# Altium project pca10095.PrjPCB (part 2 of 4)

## Sheet pca10095_sheet4_misc.SchDoc: PCA10095 - Miscellaneous
size A3; Organization: Nordic Semiconductor; DocumentNumber: 4; Revision: 0.8.0; SheetNumber: 4; SheetTotal: 6; Author: GETR; CompanyName: Nordic Semiconductor; DrawnBy: GETR; ProjectName: nRF53 Development Kit
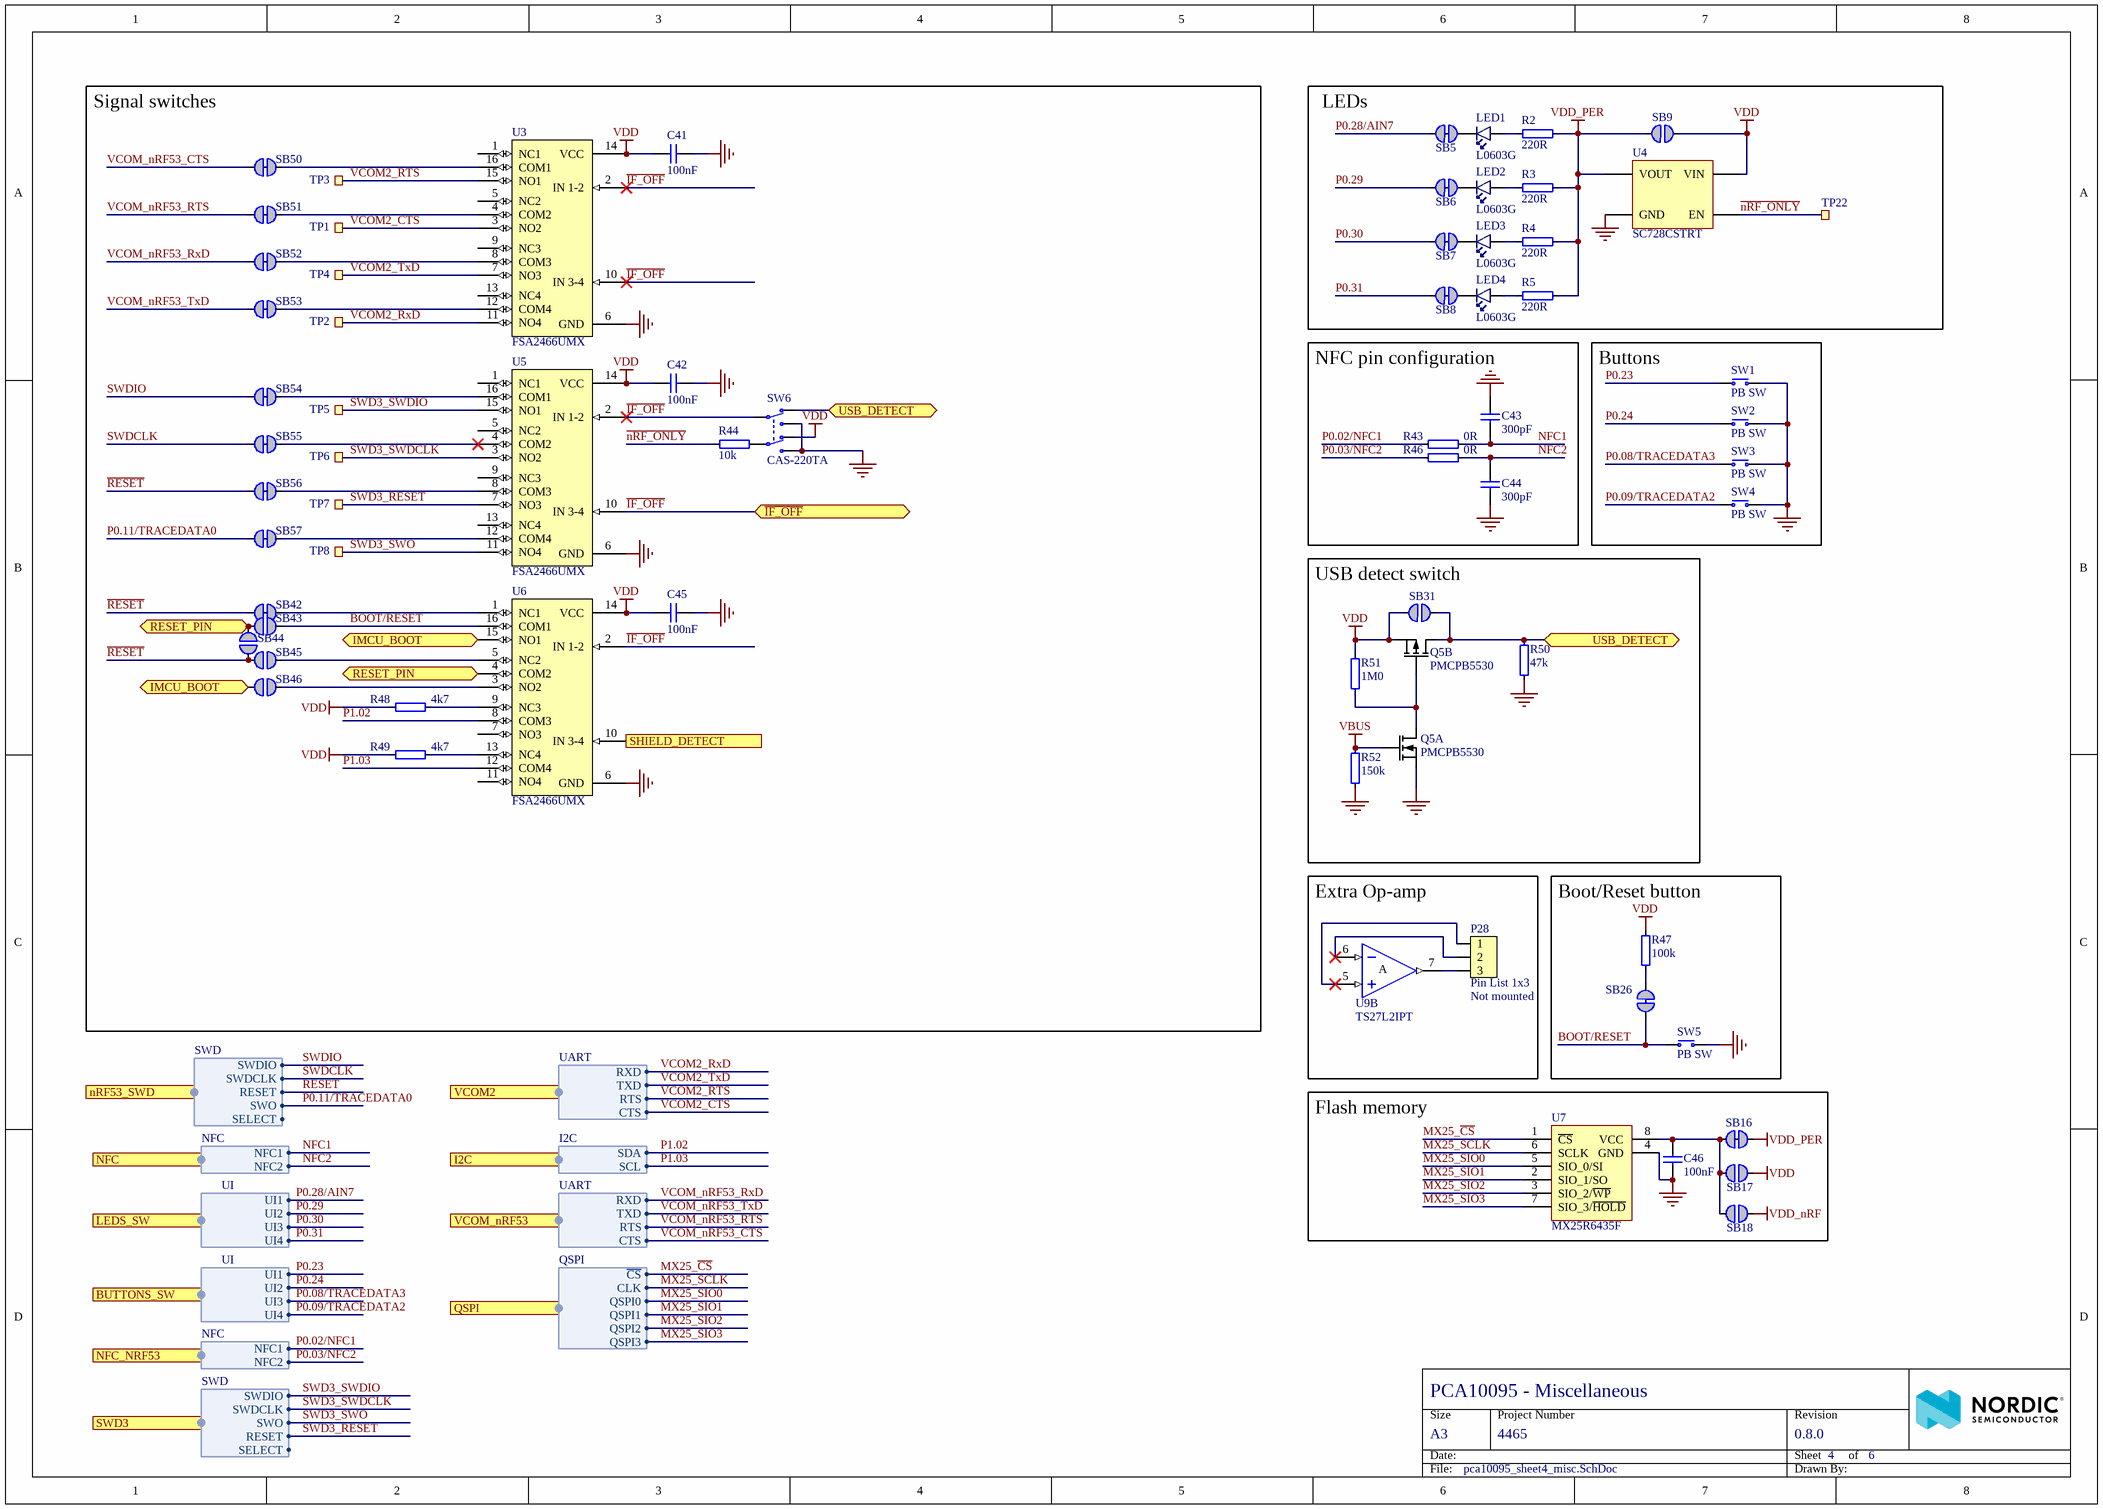
[diagram p3: pca10095_sheet4_misc.SchDoc]

### Parts
C41  100nF  [CAPC0603X03L_C]
C42  100nF  [CAPC0603X03L_C]
C43  300pF  [CAPC1005X04L]
C44  300pF  [CAPC1005X04L]
C45  100nF  [CAPC0603X03L_C]
C46  100nF  [CAPC0603X03L_C]
LED1  L0603G  [LED_0603_G]
LED2  L0603G  [LED_0603_G]
LED3  L0603G  [LED_0603_G]
LED4  L0603G  [LED_0603_G]
P28  Pin List 1x3  Assembly: Not mounted  [LIST_1x3-NC]
Q5  PMCPB5530  [PMCPB5530X]  (parts A,B of 2)
R2  220R  [RESC0603X03L_C]
R3  220R  [RESC0603X03L_C]
R4  220R  [RESC0603X03L_C]
R5  220R  [RESC0603X03L_C]
R43  0R  [RESC0603X03L_C]
R44  10k  [RESC0603X03L_C]
R46  0R  [RESC0603X03L_C]
R47  100k  [RESC0603X03L_C]
R48  4k7  [RESC0603X03L_C]
R49  4k7  [RESC0603X03L_C]
R50  47k  [RESC0603X03L_C]
R51  1M0  [RESC0603X03L_C]
R52  150k  [RESC0603X03L_C]
SB5  Solderbridge  [Solderbridge_Shorted]  (value not drawn)  (net tie, no BOM)
SB6  Solderbridge  [Solderbridge_Shorted]  (value not drawn)  (net tie, no BOM)
SB7  Solderbridge  [Solderbridge_Shorted]  (value not drawn)  (net tie, no BOM)
SB8  Solderbridge  [Solderbridge_Shorted]  (value not drawn)  (net tie, no BOM)
SB9  Solderbridge  [Solderbridge]  (value not drawn)  (no BOM)
SB16  Solderbridge  [Solderbridge_Shorted]  (value not drawn)  (net tie, no BOM)
SB17  Solderbridge  [Solderbridge]  (value not drawn)  (no BOM)
SB18  Solderbridge  [Solderbridge]  (value not drawn)  (no BOM)
SB26  Solderbridge  [Solderbridge_Shorted]  (value not drawn)  (net tie, no BOM)
SB31  Solderbridge  [Solderbridge]  (value not drawn)  (no BOM)
SB42  Solderbridge  [Solderbridge_Shorted]  (value not drawn)  (net tie, no BOM)
SB43  Solderbridge  [Solderbridge]  (value not drawn)  (no BOM)
SB44  Solderbridge  [Solderbridge]  (value not drawn)  (no BOM)
SB45  Solderbridge  [Solderbridge]  (value not drawn)  (no BOM)
SB46  Solderbridge  [Solderbridge]  (value not drawn)  (no BOM)
SB50  Solderbridge  [Solderbridge_Shorted]  (value not drawn)  (net tie, no BOM)
SB51  Solderbridge  [Solderbridge_Shorted]  (value not drawn)  (net tie, no BOM)
SB52  Solderbridge  [Solderbridge_Shorted]  (value not drawn)  (net tie, no BOM)
SB53  Solderbridge  [Solderbridge_Shorted]  (value not drawn)  (net tie, no BOM)
SB54  Solderbridge  [Solderbridge_Shorted]  (value not drawn)  (net tie, no BOM)
SB55  Solderbridge  [Solderbridge_Shorted]  (value not drawn)  (net tie, no BOM)
SB56  Solderbridge  [Solderbridge_Shorted]  (value not drawn)  (net tie, no BOM)
SB57  Solderbridge  [Solderbridge_Shorted]  (value not drawn)  (net tie, no BOM)
SW1  PB SW  [Switch-PB-6.2x6.3mm-SMD]
SW2  PB SW  [Switch-PB-6.2x6.3mm-SMD]
SW3  PB SW  [Switch-PB-6.2x6.3mm-SMD]
SW4  PB SW  [Switch-PB-6.2x6.3mm-SMD]
SW5  PB SW  [Switch-PB-6.2x6.3mm-SMD]
SW6  CAS-220TA  [CAS-220TA]
TP1  Ø1.5mm,SMD  [TP_SMD_Ø1.5mm]  (value not drawn)  (no BOM)
TP2  Ø1.5mm,SMD  [TP_SMD_Ø1.5mm]  (value not drawn)  (no BOM)
TP3  Ø1.5mm,SMD  [TP_SMD_Ø1.5mm]  (value not drawn)  (no BOM)
TP4  Ø1.5mm,SMD  [TP_SMD_Ø1.5mm]  (value not drawn)  (no BOM)
TP5  Ø1.5mm,SMD  [TP_SMD_Ø1.5mm]  (value not drawn)  (no BOM)
TP6  Ø1.5mm,SMD  [TP_SMD_Ø1.5mm]  (value not drawn)  (no BOM)
TP7  Ø1.5mm,SMD  [TP_SMD_Ø1.5mm]  (value not drawn)  (no BOM)
TP8  Ø1.5mm,SMD  [TP_SMD_Ø1.5mm]  (value not drawn)  (no BOM)
TP22  Ø1.5mm,SMD  [TP_SMD_Ø1.5mm]  (value not drawn)  (no BOM)
U3  FSA2466UMX  [XQFN40P180X260X50-16N]
U4  SC728CSTRT  [BGA4C40P2X2_76X76X62]
U5  FSA2466UMX  [XQFN40P180X260X50-16N]
U6  FSA2466UMX  [XQFN40P180X260X50-16N]
U7  MX25R6435F  [SON127P600X80_HS-9N]
U9  TS27L2IPT  [TSOP65P640X120-8N]  (part B of 2)

### Blocks framed on the sheet
Signal switches: C41 C42 C45 R44 R48 R49 SB42-SB46 SB50-SB57 SW6 TP1-TP8 U3 U5 U6
LEDs: LED1-LED4 R2-R5 SB5-SB9 TP22 U4
NFC pin configuration: C43 C44 R43 R46
Buttons: SW1-SW4
USB detect switch: Q5 R50-R52 SB31
Extra Op-amp: P28 U9
Boot/Reset button: R47 SB26 SW5
Flash memory: C46 SB16-SB18 U7

### Ports
BUTTONS_SW (harness UI), I2C (harness I2C), IMCU_BOOT (bidir), LEDS_SW (harness UI), NFC (harness NFC), NFC_NRF53 (harness NFC), nRF53_SWD (harness SWD), QSPI (harness QSPI), RESET_PIN (bidir), SHIELD_DETECT (in), SWD3 (harness SWD), USB_DETECT (bidir), VCOM2 (harness UART), VCOM_nRF53 (harness UART), ~{IF_OFF} (bidir)

### Harnesses
SWD: SWDIO, SWDCLK, SWO, RESET, SELECT
NFC: NFC2, NFC1
UI: UI4, UI3, UI2, UI1
QSPI: ~{CS}, QSPI0, CLK, QSPI1, QSPI2, QSPI3
UART: RTS, CTS, RXD, TXD
I2C: SCL, SDA

### Nets
GND: C41.1 C42.1 C43.2 C44.1 C45.1 C46.1 Q5.1(S1) R50.2 R52.2 SW1.1(N.O) SW2.1(N.O) SW3.1(N.O) SW4.1(N.O) SW5.1(N.O) SW6.1(N.O-1) SW6.4(N.O-2) U3.6(GND) U4.B1(GND) U5.6(GND) U6.6(GND) U7.4(GND) U7.9(GND)
VBUS: Q5.2(G1) R52.1
VDD: C41.2 C42.2 C45.2 Q5.4(S2) R47.2 R48.1 R49.1 R51.1 SB9.1 SB17.1 SB31.1 SW6.6(N.C-2) U3.14(VCC) U4.A2(VIN) U5.14(VCC) U6.14(VCC)
VDD_nRF: SB18.1
VDD_PER: R2.2 R3.2 R4.2 R5.2 SB9.2 SB16.1 U4.A1(VOUT)
BOOT/RESET: SB26.1 SB43.1 SW5.2(COM) U6.16(COM1)
~{IF_OFF}: SW6.2(COM-1) U3.2(IN_1-2) U3.10(IN_3-4) U5.2(IN_1-2) U5.10(IN_3-4) U6.2(IN_1-2) ; port ~{IF_OFF}
IMCU_BOOT: SB46.2 U6.15(NO1) ; port IMCU_BOOT
MX25_~{CS}: U7.1(~{CS}) ; port QSPI.~{CS}
MX25_SCLK: U7.6(SCLK) ; port QSPI.CLK
MX25_SIO0: U7.5(SIO_0/SI) ; port QSPI.QSPI0
MX25_SIO1: U7.2(SIO_1/SO) ; port QSPI.QSPI1
MX25_SIO2: U7.3(SIO_2/~{WP}) ; port QSPI.QSPI2
MX25_SIO3: U7.7(SIO_3/~{HOLD}) ; port QSPI.QSPI3
~{nRF_ONLY}: R44.1 TP22.1 U4.B2(EN)
NFC1: C43.1 R43.1 ; port NFC.NFC1
NFC2: C44.2 R46.1 ; port NFC.NFC2
P0.02/NFC1: R43.2 ; port NFC_NRF53.NFC1
P0.03/NFC2: R46.2 ; port NFC_NRF53.NFC2
P0.08/TRACEDATA3: SW3.2(COM) ; port BUTTONS_SW.UI3
P0.09/TRACEDATA2: SW4.2(COM) ; port BUTTONS_SW.UI4
P0.11/TRACEDATA0: SB57.1 ; port nRF53_SWD.SWO
P0.23: SW1.2(COM) ; port BUTTONS_SW.UI1
P0.24: SW2.2(COM) ; port BUTTONS_SW.UI2
P0.28/AIN7: SB5.1 ; port LEDS_SW.UI1
P0.29: SB6.1 ; port LEDS_SW.UI2
P0.30: SB7.1 ; port LEDS_SW.UI3
P0.31: SB8.1 ; port LEDS_SW.UI4
P1.02: U6.8(COM3) ; port I2C.SDA
P1.03: U6.12(COM4) ; port I2C.SCL
~{RESET}: SB42.2 SB44.2 SB45.2 SB56.1 ; port nRF53_SWD.RESET
SWD3_RESET: TP7.1 U5.7(NO3) ; port SWD3.RESET
SWD3_SWDCLK: TP6.1 U5.3(NO2) ; port SWD3.SWDCLK
SWD3_SWDIO: TP5.1 U5.15(NO1) ; port SWD3.SWDIO
SWD3_SWO: TP8.1 U5.11(NO4) ; port SWD3.SWO
SWDCLK: SB55.1 ; port nRF53_SWD.SWDCLK
SWDIO: SB54.1 ; port nRF53_SWD.SWDIO
VCOM2_CTS: TP1.1 U3.3(NO2) ; port VCOM2.CTS
VCOM2_RTS: TP3.1 U3.15(NO1) ; port VCOM2.RTS
VCOM2_RxD: TP2.1 U3.11(NO4) ; port VCOM2.RXD
VCOM2_TxD: TP4.1 U3.7(NO3) ; port VCOM2.TXD
VCOM_nRF53_CTS: SB50.1 ; port VCOM_nRF53.CTS  [project net P0.21]
VCOM_nRF53_RTS: SB51.1 ; port VCOM_nRF53.RTS  [project net P0.19]
VCOM_nRF53_RxD: SB52.1 ; port VCOM_nRF53.RXD  [project net P0.22]
VCOM_nRF53_TxD: SB53.1 ; port VCOM_nRF53.TXD  [project net P0.20]
NetC46_2: C46.2 SB16.2 SB17.2 SB18.2 U7.8(VCC)
NetLED1_1: LED1.1(C) SB5.2
NetLED1_2: LED1.2(A) R2.1
NetLED2_1: LED2.1(C) SB6.2
NetLED2_2: LED2.2(A) R3.1
NetLED3_1: LED3.1(C) SB7.2
NetLED3_2: LED3.2(A) R4.1
NetLED4_1: LED4.1(C) SB8.2
NetLED4_2: LED4.2(A) R5.1
NetP1_3: SB43.2 SB44.1 U6.4(COM2) ; port RESET_PIN
NetP28_1: P28.1 U9.5(IN2+)
NetP28_2: P28.2 U9.6(IN2-)
NetP28_3: P28.3 U9.7(OUT2)
NetQ5_3: Q5.3(D2) R50.1 SB31.2 SW6.3(N.C-1) ; port USB_DETECT
NetQ5_5: Q5.5(G2) Q5.6(D1) R51.2
NetR44_2: R44.2 SW6.5(COM-2)
NetR47_1: R47.1 SB26.2
NetR48_2: R48.2 U6.9(NC3)
NetR49_2: R49.2 U6.13(NC4)
NetR57_1: U6.10(IN_3-4) ; port SHIELD_DETECT
NetSB42_1: SB42.1 U6.1(NC1)
NetSB45_1: SB45.1 U6.5(NC2)
NetSB46_1: SB46.1 U6.3(NO2)
NetSB50_2: SB50.2 U3.16(COM1)
NetSB51_2: SB51.2 U3.4(COM2)
NetSB52_2: SB52.2 U3.8(COM3)
NetSB53_2: SB53.2 U3.12(COM4)
NetSB54_2: SB54.2 U5.16(COM1)
NetSB55_2: SB55.2 U5.4(COM2)
NetSB56_2: SB56.2 U5.8(COM3)
NetSB57_2: SB57.2 U5.12(COM4)

Not connected (* = marked no-connect by the designer): U3 1(NC1) 5(NC2) 9(NC3) 13(NC4); U5 1(NC1) 5(NC2) 9(NC3) 13(NC4); U6 7(NO3) 11(NO4)

### Notes on the sheet
- Size
- Date:
- A3
- Project Number
- Sheet         of
- Revision
- File:
- Drawn By:
- (in symbol TS27L2IPT, part B) A

### Library data of the parts
C41 C42 C45 C46 = C0201-100n: Capacitor, X5R, ±10%; Part number IPS: 00000001248; Note: 16V; Artikkelnr Noca: N.A.; Part Number: C0201-100n; Manufacturer: *; Manufacturer Part Number: *; Footprint Doc: 0201; LatestRevisionDate: 2017-11-09; Pin Count: 2; Publisher: Nordic Semiconductor; Published: 2014-11-13; Value: 100nF; ComponentLink1URL: *; ComponentLink1Description: Datasheet; ComponentLink2URL: *; ComponentLink2Description: Supplier link; HelpURL: *; Supplier 1: *; Supplier Part Number 1: *; Supplier 2: *; Supplier Part Number 2: *
C43 C44 = C0402-300p: Capacitor, NP0, ±5%; Part number IPS: N.A.; Note: 50V; Artikkelnr Noca: 20020004; Part Number: C0402-300p; Manufacturer: *; Manufacturer Part Number: *; Footprint Doc: 0402; LatestRevisionDate: 2016-08-25; Pin Count: 2; Publisher: Nordic Semiconductor; Published: 2015-05-29; Value: 300pF; ComponentLink1URL: *; ComponentLink1Description: Datasheet; ComponentLink2URL: *; ComponentLink2Description: Supplier link; HelpURL: *; Supplier 1: Digi-Key; Supplier Part Number 1: 490-3234-1-ND; Supplier 2: *; Supplier Part Number 2: *
LED1-LED4 = VS 25C7M5: LED, Green, 0603, 573nm, Vf=2.0V, 24mcd, - 40 to +85°C; Manufacturer: Victory Electronics; Part number IPS: N.A.; Artikkelnr Noca: 13019193; Part Number: VS 25C7M5; Manufacturer Part Number: VS 25C7M5; Footprint Doc: 0603; LatestRevisionDate: 2017-08-21; Pin Count: 2; Publisher: Nordic Semiconductor; Published: 2017-08-21; Value: L0603G; Note: *; ComponentLink1URL: *; ComponentLink1Description: Datasheet; ComponentLink2URL: *; ComponentLink2Description: Supplier link; HelpURL: \\hizz\pro\app9717\Datasheet\optoelectronics\Victory Electronics\VS 25C7M5.pdf; Supplier 1: EC Partner; Supplier Part Number 1: *; Supplier 2: *; Supplier Part Number 2: *
P28 = Pin List 1x3, N.C.: Pin List 1x3, 2.54mm (100mil); Artikkelnr Noca: N.A.; Part Number: Pin List 1x3, N.C.; Manufacturer: *; Manufacturer Part Number: *; Footprint Doc: LIST_1x3; LatestRevisionDate: 2017-09-07; Pin Count: 3; Publisher: Nordic Semiconductor; Published: 2017-09-07; Value: Pin List 1x3; Note: *; Part number IPS: N.A.; ComponentLink1URL: *; ComponentLink1Description: Datasheet; ComponentLink2URL: *; ComponentLink2Description: Supplier link; HelpURL: *; Supplier 1: *; Supplier Part Number 1: *; Supplier 2: *; Supplier Part Number 2: *
Q5 = PMCPB5530X,115: Mosfet Array N and P-Channel 20V 4A (Ta), 3.4A (Ta) 490mW Surface Mount 6-HUSON-EP (2x2); Manufacturer: Nexperia; Artikkelnr Noca: N.A.; Part Number: PMCPB5530X,115; Manufacturer Part Number: PMCPB5530X,115; LatestRevisionDate: 2018-04-30; Pin Count: 8; Publisher: Nordic Semiconductor; Published: 2018-04-30; Value: PMCPB5530; Note: *; Footprint Doc: 6-UDFN; Part number IPS: N.A.; ComponentLink1URL: https://assets.nexperia.com/documents/data-sheet/PMCPB5530X.pdf; ComponentLink1Description: Datasheet; ComponentLink2URL: https://www.digikey.com/product-detail/en/nexperia-usa-inc/PMCPB5530X115/1727-1327-1-ND/4386339; ComponentLink2Description: Supplier link; HelpURL: https://www.nexperia.com/products/mosfets/small-signal-mosfets/PMCPB5530X.html; Supplier 1: Digi-Key; Supplier Part Number 1: 1727-1327-1-ND; Supplier 2: Mouser; Supplier Part Number 2: 771-PMCPB5530X115
R2-R5 = R0201-220: Resistor, ±1%, 0.05W; Part number IPS: 00000000863; Note: Chip Res 1%; Artikkelnr Noca: N.A.; Part Number: R0201-220; Manufacturer: *; Manufacturer Part Number: *; LatestRevisionDate: 2014-11-13; Pin Count: 2; Publisher: Nordic Semiconductor; Published: 2014-11-13; Value: 220R; Footprint Doc: 0201; ComponentLink1URL: *; ComponentLink1Description: Datasheet; ComponentLink2URL: *; ComponentLink2Description: Supplier link; HelpURL: *; Supplier 1: *; Supplier Part Number 1: *; Supplier 2: *; Supplier Part Number 2: *
R43 R46 = R0201-0R: Resistor, ±5%, 0.05W; Part number IPS: 00000003245; Note: Chip Res 5%; Artikkelnr Noca: N.A.; Part Number: R0201-0R; Manufacturer: *; Manufacturer Part Number: *; Footprint Doc: 0201; LatestRevisionDate: 2017-11-09; Pin Count: 2; Publisher: Nordic Semiconductor; Published: 2014-11-13; Value: 0R; ComponentLink1URL: *; ComponentLink1Description: Datasheet; ComponentLink2URL: *; ComponentLink2Description: Supplier link; HelpURL: *; Supplier 1: *; Supplier Part Number 1: *; Supplier 2: *; Supplier Part Number 2: *
R44 = R0201-10k: Resistor, ±1%, 0.05W; Part number IPS: 00000001255; Note: Chip Res 1%; Artikkelnr Noca: N.A.; Part Number: R0201-10k; Manufacturer: *; Manufacturer Part Number: *; Footprint Doc: 0201; LatestRevisionDate: 2014-11-13; Pin Count: 2; Publisher: Nordic Semiconductor; Published: 2014-11-13; Value: 10k; ComponentLink1URL: *; ComponentLink1Description: Datasheet; ComponentLink2URL: *; ComponentLink2Description: Supplier link; HelpURL: *; Supplier 1: *; Supplier Part Number 1: *; Supplier 2: *; Supplier Part Number 2: *
R47 = R0201-100k: Resistor, ±1%, 0.05W; Part number IPS: 00000001419; Note: Chip Res 1%; Artikkelnr Noca: N.A.; Part Number: R0201-100k; Manufacturer: *; Manufacturer Part Number: *; Footprint Doc: 0201; LatestRevisionDate: 2014-11-13; Pin Count: 2; Publisher: Nordic Semiconductor; Published: 2014-11-13; Value: 100k; ComponentLink1URL: *; ComponentLink1Description: Datasheet; ComponentLink2URL: *; ComponentLink2Description: Supplier link; HelpURL: *; Supplier 1: *; Supplier Part Number 1: *; Supplier 2: *; Supplier Part Number 2: *
R48 R49 = R0201-4k7: Resistor, ±1%, 0.05W; Part number IPS: 00000001706; Note: Chip Res 1%; Artikkelnr Noca: N.A.; Part Number: R0201-4k7; Manufacturer: *; Manufacturer Part Number: *; Footprint Doc: 0201; LatestRevisionDate: 2014-11-13; Pin Count: 2; Publisher: Nordic Semiconductor; Published: 2014-11-13; Value: 4k7; ComponentLink1URL: *; ComponentLink1Description: Datasheet; ComponentLink2URL: *; ComponentLink2Description: Supplier link; HelpURL: *; Supplier 1: *; Supplier Part Number 1: *; Supplier 2: *; Supplier Part Number 2: *
R50 = R0201-47k: Resistor, ±1%, 0.05W; Part number IPS: 00000001423; Note: Chip Res 1%; Artikkelnr Noca: N.A.; Part Number: R0201-47k; Manufacturer: *; Manufacturer Part Number: *; LatestRevisionDate: 2014-11-13; Pin Count: 2; Publisher: Nordic Semiconductor; Published: 2014-11-13; Value: 47k; Footprint Doc: 0201; ComponentLink1URL: *; ComponentLink1Description: Datasheet; ComponentLink2URL: *; ComponentLink2Description: Supplier link; HelpURL: *; Supplier 1: *; Supplier Part Number 1: *; Supplier 2: *; Supplier Part Number 2: *
R51 = R0201-1M0: Resistor, ±1%, 0.05W; Part number IPS: 00000001418; Note: Chip Res 1%; Artikkelnr Noca: N.A.; Part Number: R0201-1M0; Manufacturer: *; Manufacturer Part Number: *; LatestRevisionDate: 2014-11-13; Pin Count: 2; Publisher: Nordic Semiconductor; Published: 2014-11-13; Value: 1M0; Footprint Doc: 0201; ComponentLink1URL: *; ComponentLink1Description: Datasheet; ComponentLink2URL: *; ComponentLink2Description: Supplier link; HelpURL: *; Supplier 1: *; Supplier Part Number 1: *; Supplier 2: *; Supplier Part Number 2: *
R52 = R0201-150k: Resistor, ±1%, 0.05W; Part number IPS: 00000001422; Note: Chip Res 1%; Artikkelnr Noca: N.A.; Part Number: R0201-150k; Manufacturer: *; Manufacturer Part Number: *; LatestRevisionDate: 2014-11-13; Pin Count: 2; Publisher: Nordic Semiconductor; Published: 2014-11-13; Value: 150k; Footprint Doc: 0201; ComponentLink1URL: *; ComponentLink1Description: Datasheet; ComponentLink2URL: *; ComponentLink2Description: Supplier link; HelpURL: *; Supplier 1: *; Supplier Part Number 1: *; Supplier 2: *; Supplier Part Number 2: *
SB5-SB8 SB16 SB26 SB42 SB50-SB57 = Solderbridge Shorted: Shorted Solderbridge; Artikkelnr Noca: N.A.; Part Number: Solderbridge Shorted; Manufacturer: *; Manufacturer Part Number: *; LatestRevisionDate: 2012-08-07; Pin Count: 2; Publisher: Nordic Semiconductor; Published: 2012-08-07; Value: Solderbridge; Note: *; Footprint Doc: Solderbridge_Shorted; Part number IPS: N.A.; ComponentLink1URL: *; ComponentLink1Description: Datasheet; ComponentLink2URL: *; ComponentLink2Description: Supplier link; HelpURL: *; Supplier 1: *; Supplier Part Number 1: *; Supplier 2: *; Supplier Part Number 2: *
SB9 SB17 SB18 SB31 SB43-SB46 = Solderbridge: Artikkelnr Noca: N.A.; Part Number: Solderbridge; Manufacturer: *; Manufacturer Part Number: *; LatestRevisionDate: 2009-12-14; Pin Count: 2; Publisher: Nordic Semiconductor; Published: 2009-12-14; Value: Solderbridge; Note: *; Footprint Doc: Solderbridge; Part number IPS: N.A.; ComponentLink1URL: *; ComponentLink1Description: Datasheet; ComponentLink2URL: *; ComponentLink2Description: Supplier link; HelpURL: *; Supplier 1: *; Supplier Part Number 1: *; Supplier 2: *; Supplier Part Number 2: *
SW1-SW5 = Switch-PB-6.2x6.3mm-SMD: Tactile Switch, SPNO, SMD, 160gf, 6.2x6.3x2.5mm; Manufacturer: Dailywell; Manufacturer Part Number: TS604VM1-025BR-R; Part number IPS: 00000007812; Artikkelnr Noca: 50019106; Part Number: Switch-PB-6.2x6.3mm-SMD; Footprint Doc: Switch-PB-6.2x6.3mm-SMD; LatestRevisionDate: 2016-04-21; Pin Count: 4; Publisher: Nordic Semiconductor; Published: 2010-02-01; Value: PB SW; Note: *; ComponentLink1URL: *; ComponentLink1Description: Datasheet; ComponentLink2URL: *; ComponentLink2Description: Supplier link; HelpURL: \\hizz\pro\app9717\Datasheet\switches\Dailywell\TS604VM1-025BR-R.pdf; Supplier 1: Cabcon; Supplier Part Number 1: TS604VM1-025BR-R; Supplier 2: Mouser; Supplier Part Number 2: 688-SKHUALE010
SW6 = CAS-220TA: Slide Switch DPDT J Hook; Manufacturer: Copal Electronics Inc; Part number IPS: 00000009983; Artikkelnr Noca: 50019042; Part Number: CAS-220TA; Manufacturer Part Number: CAS-220TA; Footprint Doc: CAS-220TA; LatestRevisionDate: 2010-02-18; Pin Count: 6; Publisher: Nordic Semiconductor; Published: 2010-02-18; Value: CAS-220TA; Note: *; ComponentLink1URL: *; ComponentLink1Description: Datasheet; ComponentLink2URL: *; ComponentLink2Description: Supplier link; HelpURL: http://media.digikey.com/pdf/Data%20Sheets/COPAL%20Electronics%20PDFs/CAS%20SMD%20Slide%20Switch.pdf; Supplier 1: Digi-Key; Supplier Part Number 1: CAS220JTR-ND; Supplier 2: *; Supplier Part Number 2: *
TP1-TP8 TP22 = TP_SMD_Ø1.5MM: 1.0mm circular SMD testpad; Manufacturer: Nordic Semiconductor; Artikkelnr Noca: N.A.; Part Number: TP_SMD_Ø1.5MM; Manufacturer Part Number: *; LatestRevisionDate: 2016-06-02; Pin Count: 1; Publisher: Nordic Semiconductor; Published: 2016-06-02; Value: Ø1.5mm,SMD; Note: *; Footprint Doc: TP_SMD_Ø1.5mm; Part number IPS: N.A.; ComponentLink1URL: *; ComponentLink1Description: Datasheet; ComponentLink2URL: *; ComponentLink2Description: Supplier link; HelpURL: *; Supplier 1: *; Supplier Part Number 1: *; Supplier 2: *; Supplier Part Number 2: *
U3 U5 U6 = FSA2466UMX: Data / Audio Low-Voltage Dual DPDT Analog Switch; Manufacturer: Fairchild Semiconductor; Part number IPS: 00000009986; Artikkelnr Noca: 15070069; Part Number: FSA2466UMX; Manufacturer Part Number: FSA2466UMX; Footprint Doc: UFQFN-16; LatestRevisionDate: 2016-05-18; Pin Count: 16; Publisher: Nordic Semiconductor; Published: 2016-05-18; Value: FSA2466UMX; Note: *; ComponentLink1URL: *; ComponentLink1Description: Datasheet; ComponentLink2URL: *; ComponentLink2Description: Supplier link; HelpURL: https://www.fairchildsemi.com/datasheets/FS/FSA2466.pdf; Supplier 1: Digi-Key; Supplier Part Number 1: FSA2466UMXCT-ND; Supplier 2: Mouser; Supplier Part Number 2: 512-FSA2466UMX
U4 = SC728CSTRT: Semtech, 2A Low Vin, Very Low Ron, Load Switch, 4DSBGA; Manufacturer: Semtech Corporation; Part number IPS: N.A.; Artikkelnr Noca: 15070081; Part Number: SC728CSTRT; Manufacturer Part Number: SC728CSTRT; Footprint Doc: WCSP-4; LatestRevisionDate: 2015-01-01; Pin Count: 4; Publisher: Nordic Semiconductor; Published: 2016-06-16; Value: SC728CSTRT; Note: *; ComponentLink1URL: *; ComponentLink1Description: Datasheet; ComponentLink2URL: *; ComponentLink2Description: Supplier link; HelpURL: http://www.semtech.com/images/datasheet/sc728.pdf; Supplier 1: Digi-Key; Supplier Part Number 1: SC728CSTRTCT-ND; Supplier 2: Mouser; Supplier Part Number 2: 947-SC728CSTRT
U7 = MX25R6435FZNIL0: Ultra low power, 64M-bit, serial multi I/O flash memory; Manufacturer: Macronix; Part number IPS: N.A.; Artikkelnr Noca: 15020015; Part Number: MX25R6435FZNIL0; Manufacturer Part Number: MX25R6435FZNIL0; Footprint Doc: WSON-8; LatestRevisionDate: 2016-06-29; Pin Count: 8; Publisher: Nordic Semiconductor; Published: 2016-06-29; Value: MX25R6435F; Note: *; ComponentLink1URL: *; ComponentLink1Description: Datasheet; ComponentLink2URL: *; ComponentLink2Description: Supplier link; HelpURL: http://www.macronix.com/Lists/Datasheet/Attachments/3881/MX25R6435F,%20Wide%20Range,%2064Mb,%20v1.3.pdf; Supplier 1: Future; Supplier Part Number 1: MX25R6435FZNIL0; Supplier 2: Arrow; Supplier Part Number 2: MX25R6435FZNIL0
U9 = TS27L2IPT: Precision very low power CMOS dual operational amplifier; Manufacturer: STMicroelectronics; Part number IPS: 00000009991; Artikkelnr Noca: 17010019; Part Number: TS27L2IPT; Manufacturer Part Number: TS27L2IPT; Footprint Doc: TSSOP-8; LatestRevisionDate: 2016-07-07; Pin Count: 8; Publisher: Nordic Semiconductor; Published: 2016-07-07; Value: TS27L2IPT; Note: *; ComponentLink1URL: *; ComponentLink1Description: Datasheet; ComponentLink2URL: *; ComponentLink2Description: Supplier link; HelpURL: http://www.st.com/content/ccc/resource/technical/document/datasheet/38/5b/ca/bd/c0/26/4a/34/CD00000880.pdf/files/CD00000880.pdf/jcr:content/translations/en.CD00000880.pdf; Supplier 1: Digi-Key; Supplier Part Number 1: 497-8085-1-ND; Supplier 2: *; Supplier Part Number 2: *